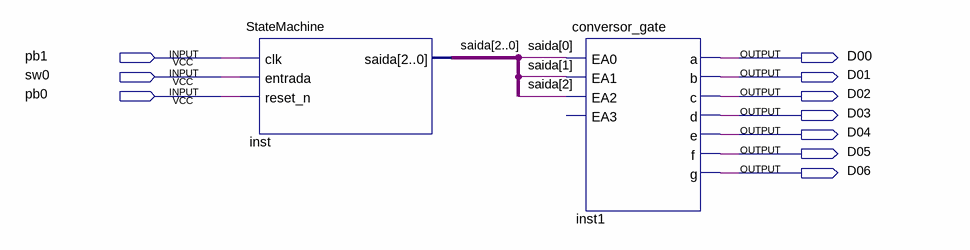
[diagram p0: schematic sheet]
// Quartus schematic detector_de_sequencia.bdf as structural Verilog: 2 symbols, 10 pins
module detector_de_sequencia (
  input  pb1,
  input  sw0,
  input  pb0,
  output D00,
  output D01,
  output D02,
  output D03,
  output D04,
  output D05,
  output D06
);

  wire [2:0] saida;

  StateMachine inst (.clk(pb1), .entrada(sw0), .reset_n(pb0), .saida(saida));
  conversor_gate inst1 (
    .EA0(saida[0]), .EA1(saida[1]), .EA2(saida[2]), .a(D00), .b(D01), .c(D02), .d(D03), .e(D04), .f(D05),
    .g(D06));  // open: EA3
endmodule
